# Altium schematic sheet DFB.SchDoc
size A3
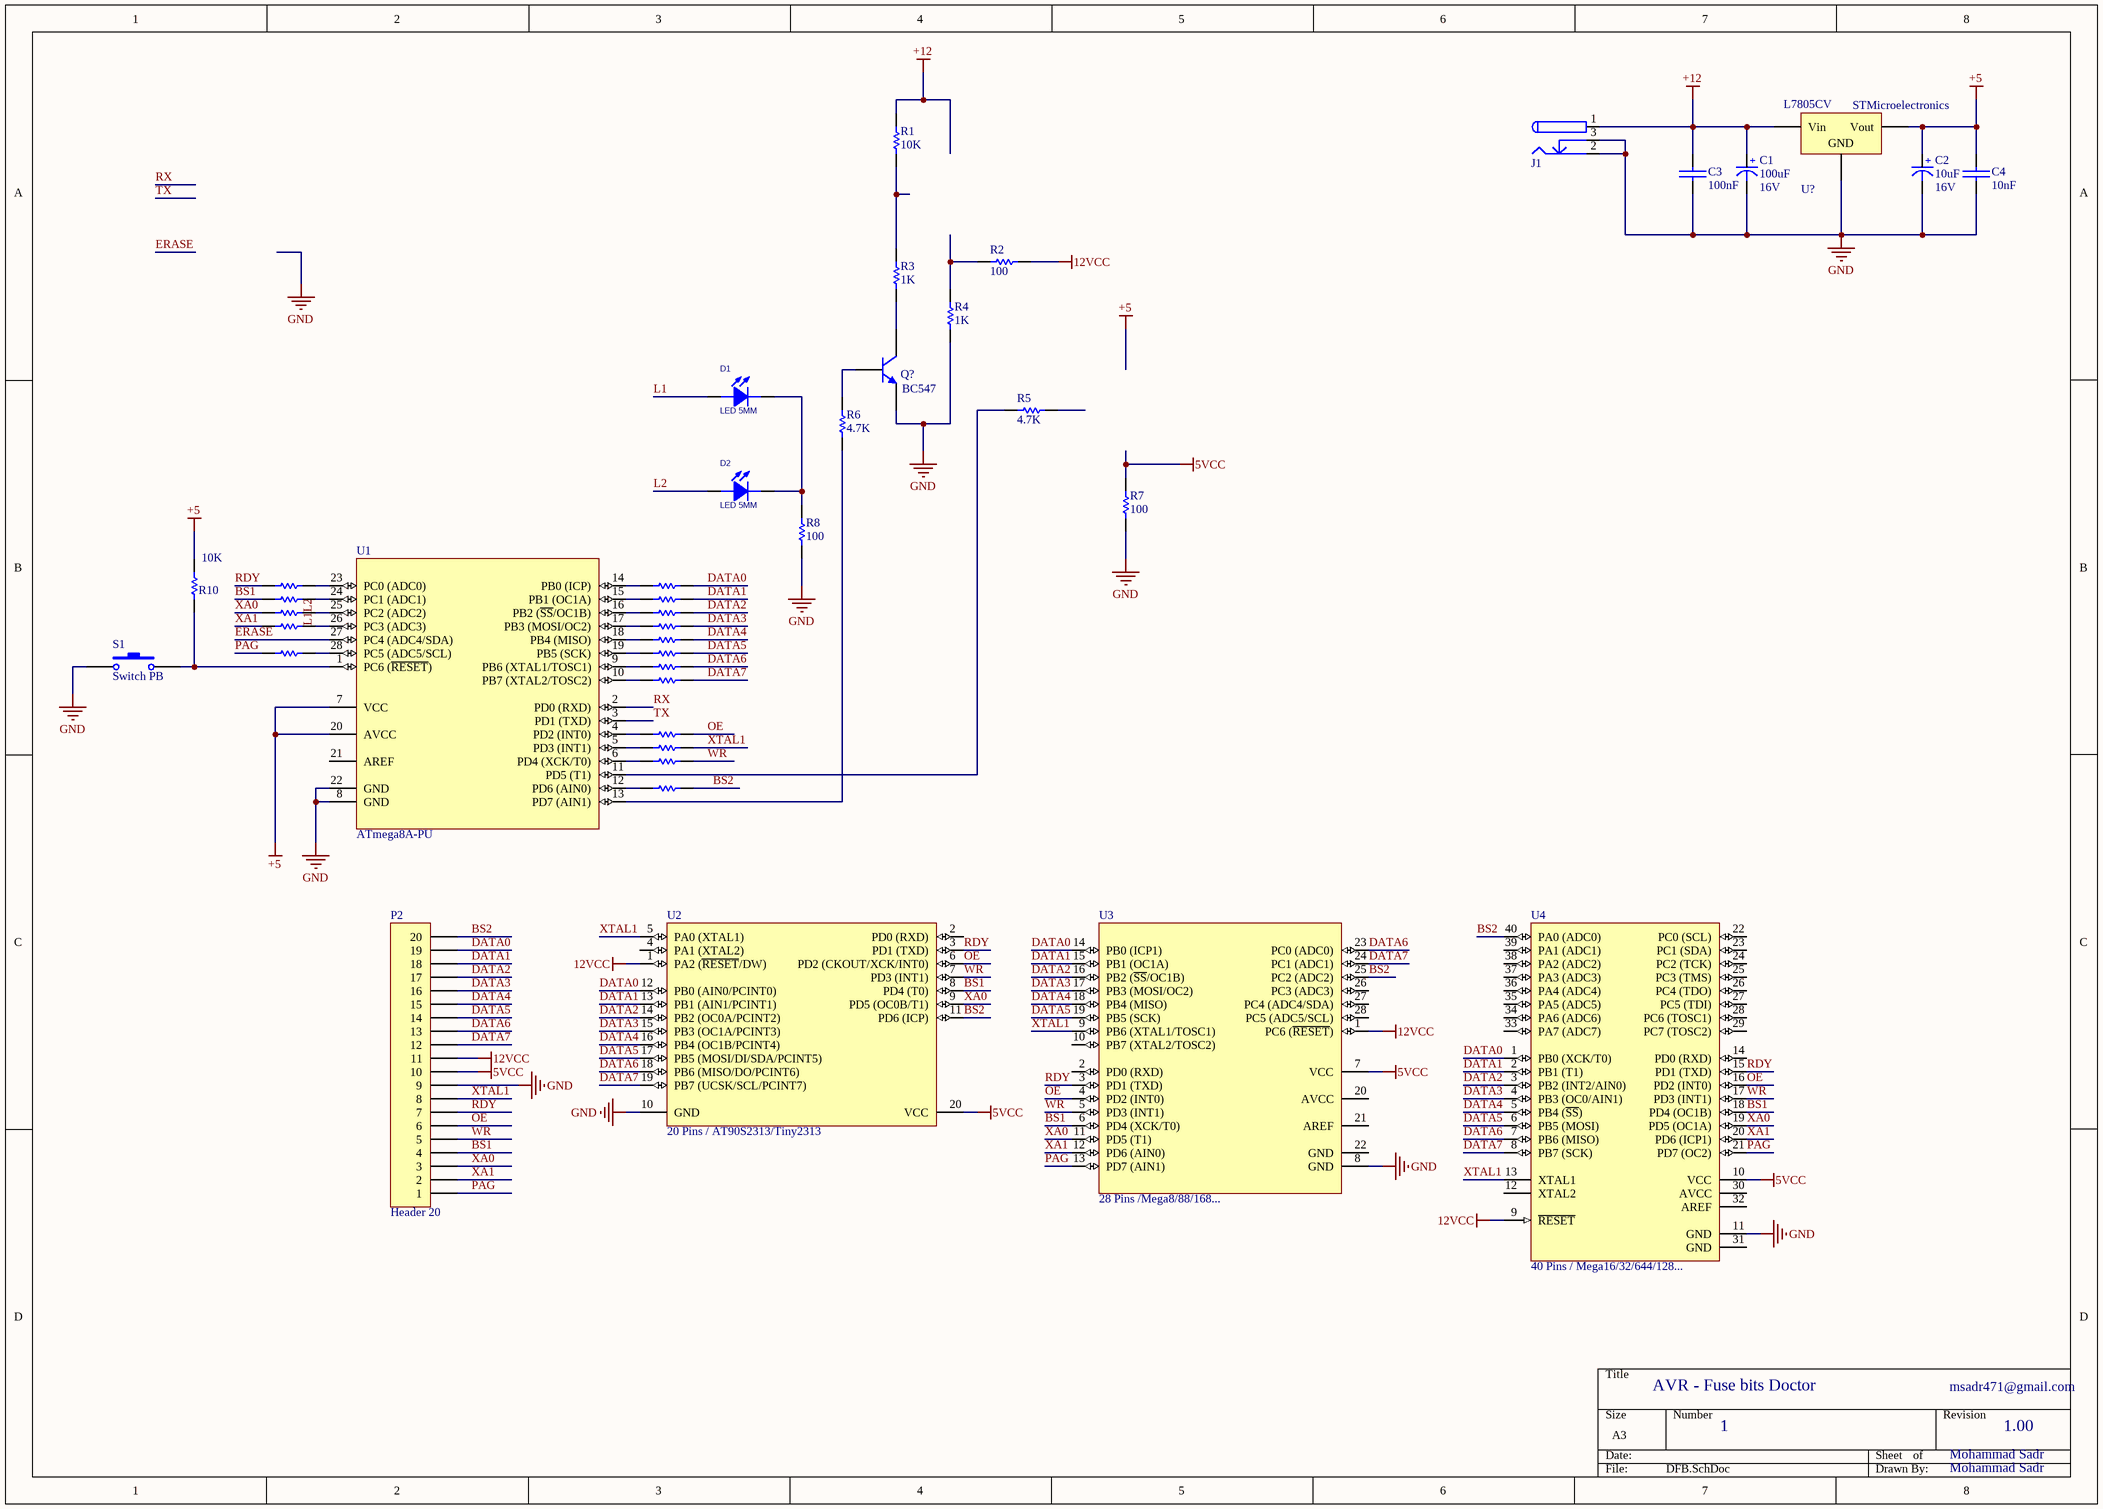
[diagram p0: DFB.SchDoc]

## Parts
C1  Voltage: 16V  [cap 01]  (hidden comment: 100uF)
C2  Voltage: 16V  [cap 01]  (hidden comment: 10uF)
C3  100nF  [Cap - 100nF]
C4  10nF  [Cap - 100nF]
D1  LED 5MM  [LED5MM_BLUE]
D2  LED 5MM  [LED5MM_GRN]
J1  DC Power Jack  [DC Power Jack 1]  (value not drawn)
P2  Header 20  [HDR1X20]
Q?  BC547  [TO-92 STR]
R1  10K  [Axial 0_25 W, 0_4 IN LEAD PITCH]
R2  100  [Axial 0_25 W, 0_4 IN LEAD PITCH]
R3  1K  [Axial 0_25 W, 0_4 IN LEAD PITCH]
R4  1K  [Axial 0_25 W, 0_4 IN LEAD PITCH]
R5  4.7K  [Axial 0_25 W, 0_4 IN LEAD PITCH]
R6  4.7K  [Axial 0_25 W, 0_4 IN LEAD PITCH]
R7  100  [Axial 0_25 W, 0_4 IN LEAD PITCH]
R8  100  [Axial 0_25 W, 0_4 IN LEAD PITCH]
R9  1K  [Axial 0_25 W, 0_4 IN LEAD PITCH]  (value not drawn)
R10  10K  [Axial 0_25 W, 0_4 IN LEAD PITCH]
R11  1K  [Axial 0_25 W, 0_4 IN LEAD PITCH]  (value not drawn)
R12  1K  [Axial 0_25 W, 0_4 IN LEAD PITCH]  (value not drawn)
R13  1K  [Axial 0_25 W, 0_4 IN LEAD PITCH]  (value not drawn)
R14  1K  [Axial 0_25 W, 0_4 IN LEAD PITCH]  (value not drawn)
R15  1K  [Axial 0_25 W, 0_4 IN LEAD PITCH]  (value not drawn)
R16  1K  [Axial 0_25 W, 0_4 IN LEAD PITCH]  (value not drawn)
R17  1K  [Axial 0_25 W, 0_4 IN LEAD PITCH]  (value not drawn)
R18  1K  [Axial 0_25 W, 0_4 IN LEAD PITCH]  (value not drawn)
R19  1K  [Axial 0_25 W, 0_4 IN LEAD PITCH]  (value not drawn)
R20  1K  [Axial 0_25 W, 0_4 IN LEAD PITCH]  (value not drawn)
R21  1K  [Axial 0_25 W, 0_4 IN LEAD PITCH]  (value not drawn)
R22  1K  [Axial 0_25 W, 0_4 IN LEAD PITCH]  (value not drawn)
R23  1K  [Axial 0_25 W, 0_4 IN LEAD PITCH]  (value not drawn)
R24  1K  [Axial 0_25 W, 0_4 IN LEAD PITCH]  (value not drawn)
R25  1K  [Axial 0_25 W, 0_4 IN LEAD PITCH]  (value not drawn)
R26  1K  [Axial 0_25 W, 0_4 IN LEAD PITCH]  (value not drawn)
S1  Switch PB  [Switch - Push to On]
U1  ATmega8A-PU  [28P3]
U2  20 Pins / AT90S2313/Tiny2313  [20P3]
U3  28 Pins /Mega8/88/168...  [28P3]
U4  40 Pins / Mega16/32/644/128...  [40P6]
U?  Manufacturer: STMicroelectronics  [TO-220 AB S]  (hidden comment: L7805CV)

## Nets
5VCC: P2.10 R7.1 U2.20(VCC) U3.7(VCC) U4.10(VCC)
12VCC: P2.11 R2.1 U2.1(PA2_(~{RESET}/DW)) U3.1(PC6_(~{RESET})) U4.9(~{RESET})
+5: C2.1(+) C4.1(+) R10.2 U1.7(VCC) U1.20(AVCC) U?.3(Vout)
+12: C1.1(+) C3.1(+) J1.1 R1.2 U?.1(Vin)
GND: C1.2(-) C2.2(-) C3.2(-) C4.2(-) J1.2 J1.3 P2.9 Q?.3(E) R4.1 R7.2 R8.2 S1.1 U1.8(GND) U1.22(GND) U2.10(GND) U3.8(GND) U4.11(GND) U?.2(GND)
BS1: P2.4 R12.1 U2.8(PD4_(T0)) U3.6(PD4_(XCK/T0)) U4.18(PD4_(OC1B))
BS2: P2.20 R26.2 U2.11(PD6_(ICP)) U3.25(PC2_(ADC2)) U4.40(PA0_(ADC0))
DATA0: P2.19 R11.2 U2.12(PB0_(AIN0/PCINT0)) U3.14(PB0_(ICP1)) U4.1(PB0_(XCK/T0))
DATA1: P2.18 R13.2 U2.13(PB1_(AIN1/PCINT1)) U3.15(PB1_(OC1A)) U4.2(PB1_(T1))
DATA2: P2.17 R15.2 U2.14(PB2_(OC0A/PCINT2)) U3.16(PB2_(~{SS}/OC1B)) U4.3(PB2_(INT2/AIN0))
DATA3: P2.16 R17.2 U2.15(PB3_(OC1A/PCINT3)) U3.17(PB3_(MOSI/OC2)) U4.4(PB3_(OC0/AIN1))
DATA4: P2.15 R18.2 U2.16(PB4_(OC1B/PCINT4)) U3.18(PB4_(MISO)) U4.5(PB4_(~{SS}))
DATA5: P2.14 R20.2 U2.17(PB5_(MOSI/DI/SDA/PCINT5)) U3.19(PB5_(SCK)) U4.6(PB5_(MOSI))
DATA6: P2.13 R21.2 U2.18(PB6_(MISO/DO/PCINT6)) U3.23(PC0_(ADC0)) U4.7(PB6_(MISO))
DATA7: P2.12 R22.2 U2.19(PB7_(UCSK/SCL/PCINT7)) U3.24(PC1_(ADC1)) U4.8(PB7_(SCK))
ERASE: U1.27(PC4_(ADC4/SDA))
L1: D1.1(ANODE) R16.2 U1.26(PC3_(ADC3))
L2: D2.1(ANODE) R14.2 U1.25(PC2_(ADC2))
OE: P2.6 R23.2 U2.6(PD2_(CKOUT/XCK/INT0)) U3.4(PD2_(INT0)) U4.16(PD2_(INT0))
PAG: P2.1 R19.1 U3.13(PD7_(AIN1)) U4.21(PD7_(OC2))
RDY: P2.7 R9.1 U2.3(PD1_(TXD)) U3.3(PD1_(TXD)) U4.15(PD1_(TXD))
RX: U1.2(PD0_(RXD))
TX: U1.3(PD1_(TXD))
WR: P2.5 R25.2 U2.7(PD3_(INT1)) U3.5(PD3_(INT1)) U4.17(PD3_(INT1))
XA0: P2.3 R14.1 U2.9(PD5_(OC0B/T1)) U3.11(PD5_(T1)) U4.19(PD5_(OC1A))
XA1: P2.2 R16.1 U3.12(PD6_(AIN0)) U4.20(PD6_(ICP1))
XTAL1: P2.8 R24.2 U2.5(PA0_(XTAL1)) U3.9(PB6_(XTAL1/TOSC1)) U4.13(XTAL1)
NetD1_2: D1.2(CATHODE) D2.2(CATHODE) R8.1
NetQ?_1: Q?.1(C) R3.1
NetQ?_2: Q?.2(B) R6.2
NetR1_1: R1.1 R3.2
NetR2_2: R2.2 R4.2
NetR5_2: R5.2 U1.11(PD5_(T1))
NetR6_1: R6.1 U1.13(PD7_(AIN1))
NetR9_2: R9.2 U1.23(PC0_(ADC0))
NetR10_1: R10.1 S1.2 U1.1(PC6_(~{RESET}))
NetR11_1: R11.1 U1.14(PB0_(ICP))
NetR12_2: R12.2 U1.24(PC1_(ADC1))
NetR13_1: R13.1 U1.15(PB1_(OC1A))
NetR15_1: R15.1 U1.16(PB2_(~{SS}/OC1B))
NetR17_1: R17.1 U1.17(PB3_(MOSI/OC2))
NetR18_1: R18.1 U1.18(PB4_(MISO))
NetR19_2: R19.2 U1.28(PC5_(ADC5/SCL))
NetR20_1: R20.1 U1.19(PB5_(SCK))
NetR21_1: R21.1 U1.9(PB6_(XTAL1/TOSC1))
NetR22_1: R22.1 U1.10(PB7_(XTAL2/TOSC2))
NetR23_1: R23.1 U1.4(PD2_(INT0))
NetR24_1: R24.1 U1.5(PD3_(INT1))
NetR25_1: R25.1 U1.6(PD4_(XCK/T0))
NetR26_1: R26.1 U1.12(PD6_(AIN0))

Not connected (* = marked no-connect by the designer): R5 1; U1 21(AREF); U2 2(PD0_(RXD)) 4(PA1_(XTAL2)); U3 2(PD0_(RXD)) 10(PB7_(XTAL2/TOSC2)) 20(AVCC) 21(AREF) 22(GND) 26(PC3_(ADC3)) 27(PC4_(ADC4/SDA)) 28(PC5_(ADC5/SCL)); U4 12(XTAL2) 14(PD0_(RXD)) 22(PC0_(SCL)) 23(PC1_(SDA)) 24(PC2_(TCK)) 25(PC3_(TMS)) 26(PC4_(TDO)) 27(PC5_(TDI)) 28(PC6_(TOSC1)) 29(PC7_(TOSC2)) 30(AVCC) 31(GND) 32(AREF) 33(PA7_(ADC7)) 34(PA6_(ADC6)) 35(PA5_(ADC5)) 36(PA4_(ADC4)) 37(PA3_(ADC3)) 38(PA2_(ADC2)) 39(PA1_(ADC1))

## Notes on the sheet
- AVR - Fuse bits Doctor
- msadr471@gmail.com
- 1
- Mohammad Sadr
- 1.00

## Library data of the parts
C1 C2 = Cap-Polar: Polar Capacitor; Designer: Saeid Jorablo; Organazation: ControTec; Adding Date: 1387/12/20
  C1: Value: 100uF
  C2: Value: 10uF
C3 C4 = Cap-Bipolar: Bipolar Capacitor; Voltage: 100V; Designer: Saeid Jorablo; Organazation: ControTec; Adding Date: 1387/12/20
  C3: Value: 100nF
  C4: Value: 10nF
D1 D2 = LED 5MM: Light Emitting Diode; Designer: Abbas Basereh; Data: 16-12-2016; Link: *; Part.No: *
J1 = DC Power Jack: DC Power Jack. Center Pin 2.5mm. Diameter: 5.7mm; Designer: Ali Hafizi; Company: Personal; Project Name: Laser; Adding Date: 10/21/2009
P2 = Header 20: Header, 20-Pin; LatestRevisionDate: 17-Jul-2002; LatestRevisionNote: Re-released for DXP Platform.; Publisher: Altium Limited
Q? = BC547: NPN General-purpose Transistor; Designer: Abbas Basereh; Desc.: Plastic Medium-Power. Silicon NPN Transistors; Data: 27-12-2016
R1-R26 = RES Axial 0.25W: Designer: Abbas Basereh; Desc.: RES Axial 0.25W; Data: 4-1-2017
S1 = Switch PB: Push Button Switch
U1 = ATmega8A-PU: 8-bit AVR Microcontroller, 8KB Flash, 512 Bytes EEPROM, 1KB SRAM, 28-pin PDIP, Industrial Grade (-40°C to 85°C); Published: 1-Apr-2010; DatasheetVersion: revC, Jul-2009; PackageVersion: revB, Sep-2001; PackageReference: 28P3; Publisher: Altium Limited; PackageDescription: 28-lead (0.300"/7.62mm Wide) Plastic Dual Inline Package (PDIP); Supplier 1: Digi-Key; Supplier Part Number 1: ATMEGA8A-PU-ND; Supplier 2: Farnell; Supplier Part Number 2: 1748534; Supplier 3: Mouser; Supplier Part Number 3: 556-ATMEGA8A-PU; ComponentLink1Description: Manufacturer Link; ComponentLink1URL: http://www.atmel.com/products/avr/default.asp?; ComponentLink2Description: ATmega8A Datasheet; ComponentLink2URL: http://www.atmel.com/dyn/resources/prod_documents/doc8159.pdf; ComponentLink3Description: ATmega8A Summary; ComponentLink3URL: http://www.atmel.com/dyn/resources/prod_documents/8159S.pdf; ComponentLink4Description: Atmel.com Home; ComponentLink4URL: http://www.atmel.com
U2 = ATtiny2313-20PI: Low Power tinyAVR® 8-Bit Microcontroller, 2K Flash Memory, 20MHz, Industrial Temperature, 20-Lead PDIP; DatasheetVersion: DOC2543B, Mar-2009; PackageVersion: revD, Oct-2010; PackageReference: 20P3; PackageDescription: 20-lead (0.300"/7.62mm Wide) Plastic Dual Inline Package (PDIP); Code_JEDEC: MS-001-AD; ComponentLink1Description: Manufacturer URL; ComponentLink1URL: http://www.atmel.com/
U3 = ATmega8A-PU: 8-bit AVR Microcontroller, 2.7-5.5V, 16MHz, 8KB Flash, 512 Bytes EEPROM, 1KB SRAM, 28-pin PDIP, Industrial Grade (-40°C to 85°C); DatasheetVersion: revD, Feb-2011; PackageVersion: revB, Sep-2001; PackageReference: 28P3; PackageDescription: 28-lead (0.300"/7.62mm Wide) Plastic Dual Inline Package (PDIP); ComponentLink1Description: Manufacturer URL; ComponentLink1URL: http://www.atmel.com/; ComponentLink2Description: ATmega8A Datasheet; ComponentLink2URL: http://www.atmel.com/dyn/resources/prod_documents/doc8159.pdf; ComponentLink3Description: ATmega8A Summary; ComponentLink3URL: http://www.atmel.com/dyn/resources/prod_documents/8159S.pdf
U4 = ATmega32A-PU: 8-bit AVR Microcontroller, 2.7-5.5V, 16MHz, 32KB Flash, 1KB EEPROM, 2KB SRAM, 40-pin PDIP, Industrial Grade (-40°C to 85°C); DatasheetVersion: revC, Feb-2011; PackageVersion: revB, Sep-2001; PackageReference: 40P6; PackageDescription: 40-lead (0.600"/15.24mm Wide) Plastic Dual Inline Package (PDIP); Code_JEDEC: MS-011-AC; ComponentLink1Description: Manufacturer URL; ComponentLink1URL: http://www.atmel.com/; ComponentLink2Description: ATmega32A Datasheet; ComponentLink2URL: http://www.atmel.com/dyn/resources/prod_documents/doc8155.pdf; ComponentLink3Description: ATmega32A Summary; ComponentLink3URL: http://www.atmel.com/dyn/resources/prod_documents/8155S.pdf
U? = L7805CV-Linear Voltage Regulator IC Positive 1 Output 5V 1.5A TO-220AB: Linear Voltage Regulator IC Positive FIXED; Designer: Abbas Basereh; Link: https://www.aliexpress.com/item/; Link: http://www.tme.eu/en/; Link: http://www.digikey.com/; Part. No: L7805CV